# Altium schematic sheet OPTICS.SchDoc
size A; SheetNumber: 1; SheetTotal: 1
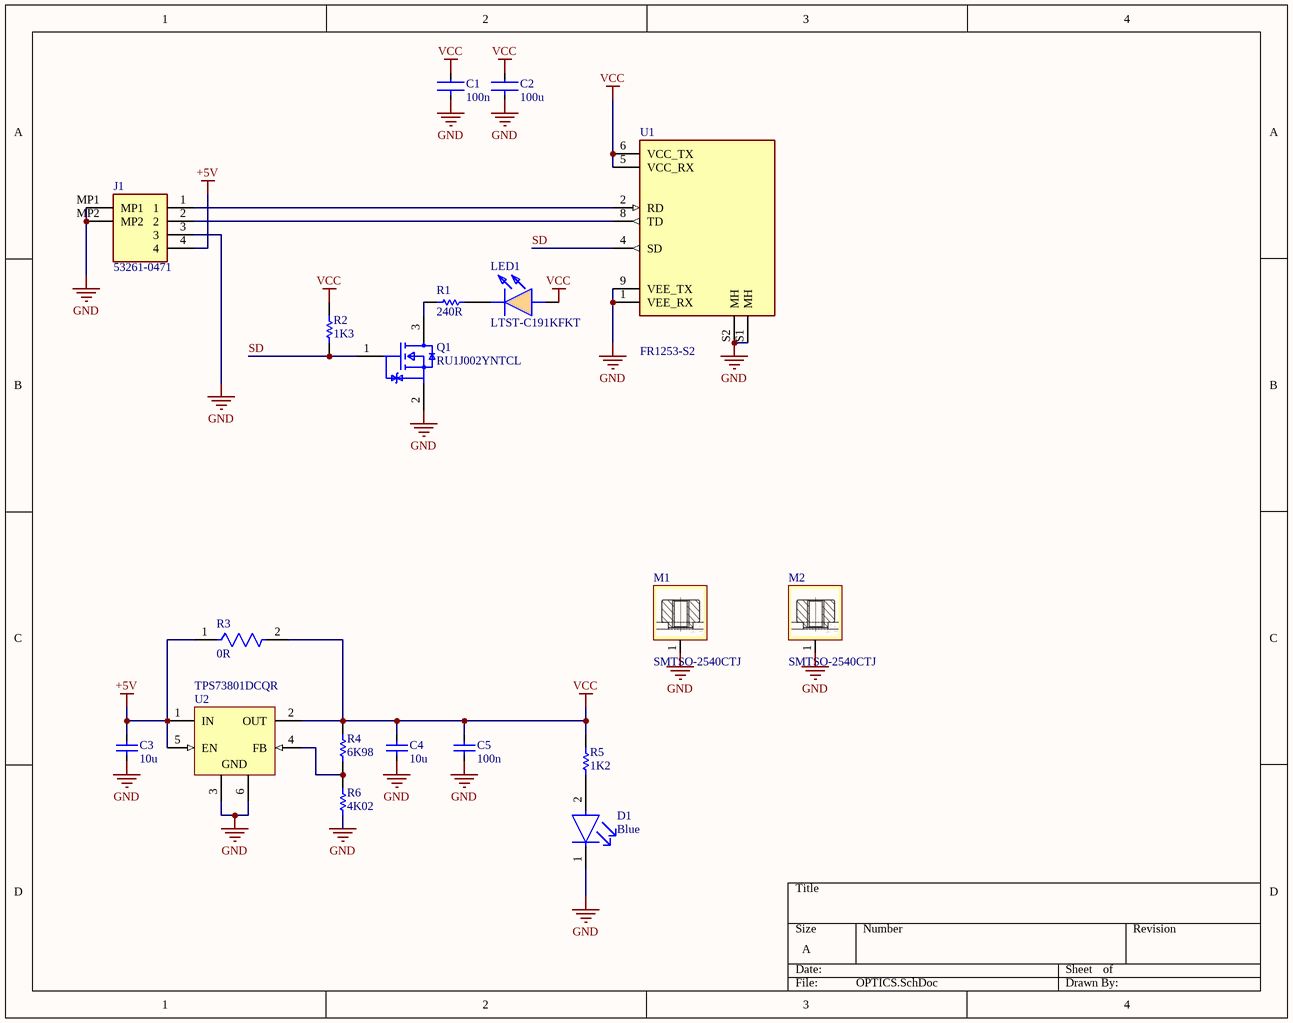
[diagram p0: OPTICS.SchDoc]

## Parts
C1  value 100n  [FP-C1005-050-0_05-IPC_B]  (hidden comment: C1005X7R1H104K050BB)
C2  value 100u  [FP-C3216-160-0_3-IPC_B]  (hidden comment: C3216X5R0G107M160AB)
C3  value 10u  [FP-C1608-080-0_1-IPC_C]  (hidden comment: C1608JB0J106K080AB)
C4  value 10u  [FP-C1608-080-0_1-IPC_C]  (hidden comment: C1608JB0J106K080AB)
C5  value 100n  [FP-C1005-050-0_05-IPC_C]  (hidden comment: C1005X7R1H104K050BB)
D1  Color: Blue  [FP-LTST-C191TBKT-MFG]  (hidden comment: LTST-C191TBKT)
J1  53261-0471  [53261-0471]
LED1  LTST-C191KFKT  [LEDC1608X55N]
M1  SMTSO-2540CTJ  [SMTSO-2540CTJ]
M2  SMTSO-2540CTJ  [SMTSO-2540CTJ]
Q1  RU1J002YNTCL  [FP-UMT3F-MFG]
R1  value 240R  [RESC0402(1005)_M]  (hidden comment: RC0402FR-07240RL)
R2  value 1K3  [RESC1005X40X25ML05T10]  (hidden comment: RC0402FR-071K3L)
R3  value 0R  [FP-RC0402-0_4-IPC_C]  (hidden comment: RC0402FR-070RL)
R4  value 6K98  [RESC1005X40X25ML05T10]  (hidden comment: RC0402FR-076K98L)
R5  value 1K2  [RESC1005X40X25ML05T10]  (hidden comment: RC0402FR-071K2L)
R6  value 4K02  [RESC1005X40X25ML05T10]  (hidden comment: RC0402FR-074K02L)
U1  FR1253-S2  [XCVR_AFBR-5803Z]
U2  TPS73801DCQR  [DCQ0006A_L]

## Nets
+5V: C3.1 J1.4 R3.1 U2.1(IN) U2.5(EN)
GND: C1.1 C2.1 C3.2 C4.2 C5.2 D1.1(C) J1.3 J1.MP1 J1.MP2 M1.1 M2.1 Q1.2(S) R6.1 U1.1(VEE_RX) U1.9(VEE_TX) U1.S1(MH) U1.S2(MH) U2.3(GND) U2.6(GND)
VCC: C1.2 C2.2 C4.1 C5.1 LED1.2(A) R2.2 R3.2 R4.2 R5.1 U1.5(VCC_RX) U1.6(VCC_TX) U2.2(OUT)
SD: Q1.1(G) R2.1 U1.4(SD)
NetD1_2: D1.2(A) R5.2
NetJ1_1: J1.1 U1.2(RD)
NetJ1_2: J1.2 U1.8(TD)
NetLED1_1: LED1.1(K) R1.1
NetQ1_3: Q1.3(D) R1.2
NetR4_1: R4.1 R6.2 U2.4(FB)

## Library data of the parts
C1 = CMP-2000-05393-2: Multilayer Ceramic Capacitors 100nF ±10% 50V X7R SMD 0402; Voltage: 50V; Dielectric Material: Ceramic; Min Operating Temperature: -55°C; Depth: 0.5mm; Radiation Hardening: No; RoHS Compliant: Yes; Voltage Rating (DC): 50V; Lead Free: Lead Free; Resistor Type: Ceramic; Height: 0.5mm; Dielectric: X7R; Thickness: 0.022inch; Case/Package: 0402; Case Code (Metric): 1005; Termination: SMD/SMT; Packaging: Tape and Reel; Max Operating Temperature: 125°C; Mount: Surface Mount; Package Quantity: 1; Width: 0.02inch; Weight: 2.3E-05oz; Voltage Rating: 50V; Tolerance: 10%; Construction: Flat; Case Code (Imperial): 0402; Length: 1mm; REACH SVHC: No SVHC; Series: C; Part Number: C1005X7R1H104K050BB
C2 = CMP-08246-005374-1: Multilayer Ceramic Capacitors 100uF ±20% 4V X5R SMD 1206; Dielectric: X5R; Voltage Rating (DC): 4V; Lead Free: Lead Free; Max Operating Temperature: 85°C; Construction: Flat; Termination: SMD/SMT; Mount: Surface Mount; Thickness: 0.071inch; Height: 1.6mm; Width: 0.063inch; Resistor Type: Ceramic; Radiation Hardening: No; Case/Package: 1206; Series: C; Weight: 0.000571oz; Depth: 1.6mm; RoHS Compliant: Yes; Dielectric Material: Ceramic; Package Quantity: 2000; Case Code (Metric): 3216; Length: 3.2mm; Case Code (Imperial): 1206; Tolerance: 20%; Packaging: Tape and Reel; Voltage Rating: 4V; Min Operating Temperature: -55°C; Part Number: C3216X5R0G107M160AB
C3 C4 = C1608JB0J106K080AB: MLCC 10μF ±10% 6.3V JB SMD 0603; Dielectric Material: Ceramic; Case Code (Imperial): 0603; Thickness: 0.035inch; Min Operating Temperature: -25°C; Termination: SMD/SMT; Lead Free: Lead Free; Resistor Type: Ceramic; Width: 0.8mm; Voltage Rating (DC): 6.3V; Package Quantity: 4000; Tolerance: 10%; Length: 0.063inch; Series: C; Height: 0.8mm; Max Operating Temperature: 85°C; Mount: Surface Mount; RoHS Compliant: Yes; Voltage Rating: 6.3V; Case Code (Metric): 1608; Case/Package: 0603; Packaging: Tape and Reel
C5 = C1005X7R1H104K050BB: MLCC 100nF ±10% 50V X7R SMD 0402; Dielectric Material: Ceramic; Voltage: 50V; Min Operating Temperature: -55°C; Depth: 0.5mm; Radiation Hardening: No; RoHS Compliant: Yes; Voltage Rating (DC): 50V; Lead Free: Lead Free; Resistor Type: Ceramic; Height: 0.5mm; Dielectric: X7R; Thickness: 0.022inch; Case/Package: 0402; Case Code (Metric): 1005; Termination: SMD/SMT; Packaging: Tape and Reel; Max Operating Temperature: 125°C; Mount: Surface Mount; Package Quantity: 1; Width: 0.02inch; Weight: 2.3E-05oz; Voltage Rating: 50V; Tolerance: 10%; Construction: Flat; Case Code (Imperial): 0402; Length: 1mm; REACH SVHC: No SVHC; Series: C; Part Number: C1005X7R1H104K050BB
D1 = CMP-22017-000008-1: LED BLUE CLEAR CHIP SMD; Lens Color: Colorless; Dominant Wavelength: 475nm; Forward Current: 20mA; Wavelength: 468nm; Viewing Angle: 130°; Power Dissipation: 76mW; Luminous Intensity: 180mcd; Reverse Voltage: 5V; Number of Elements: 1; Lens Style: Diffused; Forward Voltage: 3.8V; Max Power Dissipation: 75mW; Case Code (Metric): 1608; Packaging: Tape and Reel; Case/Package: 0603; Depth: 1.6mm; Mount: Surface Mount; Lead Free: Lead Free; Min Operating Temperature: -20°C; Lens Transparency: Clear; Illumination Color: Blue; Height: 0.55mm; Test Current: 20mA; Case Code (Imperial): 0603; Max Operating Temperature: 80°C; Number of Pins: 2; Length: 0.8mm; Radiation Hardening: No; Package Quantity: 1; Number of LEDs: 1; Width: 0.8mm
J1 = 53261-0471: Connector; Manufacturer_Name: Molex; Datasheet Link: http://www.molex.com/webdocs/datasheets/pdf/en-us//0532610471_PCB_HEADERS.pdf; Manufacturer_Part_Number: 53261-0471; Mouser Part Number: 538-53261-0471; Mouser Price/Stock: https://www.mouser.co.uk/ProductDetail/Molex/53261-0471?qs=%252B72YyncTwW9e3et3PwnEMw%3D%3D; Arrow Part Number: 53261-0471; Arrow Price/Stock: null?region=nac
LED1 = LTST-C191KFKT: LED; Manufacturer: Lite-On; Value: Orange; Datasheet Link: https://datasheet.datasheetarchive.com/originals/distributors/Datasheets-305/79307.pdf; Height: 0.55mm; Mouser Part Number: 859-LTST-C191KFKT; Mouser Price/Stock: https://www.mouser.co.uk/ProductDetail/Lite-On/LTST-C191KFKT?qs=1bx9pL%2Fk%252BiAv01YAc0eitQ%3D%3D; Arrow Part Number: LTST-C191KFKT; Arrow Price/Stock: https://www.arrow.com/en/products/ltst-c191kfkt/lite-on-technology.html?utm_currency=USD&region=nac; Part Number: LTST-C191KFKT
Q1 = RU1J002YNTCL: MOSFET N-CH 50V 0.2A UMT3F; Manufacturer: Rohm; Drain To Source Resistance: 1.6Ω; Depletion Mode: False; Continuous Drain Current: 200mA; Pulse Drain Current: 800mA; Turn On Delay Time: 5ns; Threshold Vgs Max: 0.8V; Rthja Max: 833°C/W; Max Forward Diode Voltage: 1.2V; Max Junction Temp: +150°C; Standoff Height: 0mm; Input Capacitace At Vds: 26pF @ 10V; Number Of Channels: 1; Power Dissipation: 150mW; Gate To Source Voltage: 8V; Turn Off Delay Time: 17ns; Threshold Vgs Min: 0.3V; Lead Free: Yes; Device Class L3: MOSFETs; Drain To Source Voltage: 50V; ComponentLink2URL: https://d1d2qsbl8m0m72.cloudfront.net/en/products/databook/datasheet/discrete/transistor/mosfet/ru1j002yn-e.pdf; RoHS: TRUE; Device Class L2: Transistors; Mouser Description: MOSFET 0.9V Drive Nch MOSFET; Category: Trans; Octopart: https://octopart.com/ru1j002yntcl-rohm-47197697; Temperature: to +150°C; Height: 1.05mm; Number Of N Channels: 1; Package: UMT3F; ComponentLink2Description: Datasheet; Automotive: No; Drain To Source Breakdown Voltage: 50V; Device Class L1: Discrete Semiconductors; Digikey Description: MOSFET N-CH 50V 0.2A UMT3F; Manufacturer Part Number: RU1J002YNTCL; Temperature Range High: +150°C
R1 = CMP-1011-00438-1: 240R 0.063W 1% 0402 (1005 Metric)  SMD; Case-Metric: 1005; Case-EIA: 0402; Power: 0.063 W; Tolerance: 1 %; Technology: SMT; Part Number: RC0402FR-07240RL; Parameter 1: *
R2 = CMP-2002-07459-1: Manufacturer: Yageo / Phycomp; Part Number: RC0402FR-071K3L
R3 = CMP-2002-07342-2: RES SMD 0 OHM JUMPER 1/16W 0402; Temperature Coefficient: 200ppm/°C; Tolerance: 1%; Power Rating: 62.5mW; Voltage Rating: 50V; Max Power Dissipation: 63mW; Resistance: 0R; Features: Moisture Resistant; Length: 1mm; Case Code (Metric): 1005; Series: RC; RoHS Compliant: Yes; Resistor Type: Thick Film; Height: 0.35mm; Min Operating Temperature: -55°C; Case Code (Imperial): 0402; Number of Terminations: 2; Contact Plating: Tin; Case/Package: 0402; Size Code: 0402; Termination: SMD/SMT; Max Operating Temperature: 155°C; Width: 0.5mm; Mount: Surface Mount; Lead Free: Lead Free; Packaging: Tape and Reel; Radiation Hardening: No
R4 = CMP-2002-07119-1: Manufacturer: Yageo / Phycomp; Part Number: RC0402FR-076K98L
R5 = CMP-2002-07456-1: Manufacturer: Yageo / Phycomp; Part Number: RC0402FR-071K2L
R6 = CMP-2002-07710-1: Manufacturer: Yageo / Phycomp; Part Number: RC0402FR-074K02L
U1 = FR12XX: Fiber Optic Transceiver Module General Purpose 100Mbps 1300nm 3.3V, 5V SC Through Hole; MP: AFBR-5803Z; MF: Broadcom Limited; Package: None; Digi-Key_Purchase_URL: https://www.digikey.com/product-detail/en/broadcom-limited/AFBR-5803Z/516-1991-ND/1990389?utm_source=snapeda&utm_medium=aggregator&utm_campaign=symbol; Digi-Key_Part_Number: 516-1991-ND; SnapEDA_Link: https://www.snapeda.com/parts/AFBR-5803Z/Broadcom%20Limited/view-part/125759/?ref=snap
U2 = CMP-0395-00479-2: Single Output Fast Transient Response LDO, 1 A, Adjustable 1.2 to 20 V Output, 2.2 to 20 V Input, 6-pin SOT-223 (DCQ), -40 to 125 degC, Green (RoHS & no Sb/Br); Manufacturer: Texas Instruments; Vdo(Typ)(mV): 300; SubFamily: Single Channel LDO; Vin(Min)(V): 2.2; Vin(Max)(V): 20; Iout(Max)(A): 1; Vout Adj(Min)(V): 1.2; Mounting Technology: Surface Mount; PackageVersion: 4202109/D; ComponentLink1URL: http://www.ti.com/; ComponentLink3URL: http://www.ti.com/litv/pdf/mpds098c; Eco-Plan: Green (RoHS & no Sb/Br); ComponentLink2URL: http://www.ti.com/general/docs/lit/getliterature.tsp?genericPartNumber=TPS73801&fileType=pdf; ComponentLink3Description: Package Specification; Vout Adj(Max)(V): 20; PackageReference: DCQ0006A; ComponentLink1Description: Manufacturer URL; ComponentLink2Description: Datasheet; Iq(Typ)(mA): 1; DatasheetVersion: SLVS915A; PackageDescription: 6-Pin Plastic Small Outline, Body 3.5 x 6.5 mm, Pitch 1.27 mm; PartNumber: TPS73801DCQR